# EAGLE design UV-Led (EAGLE 6.2)
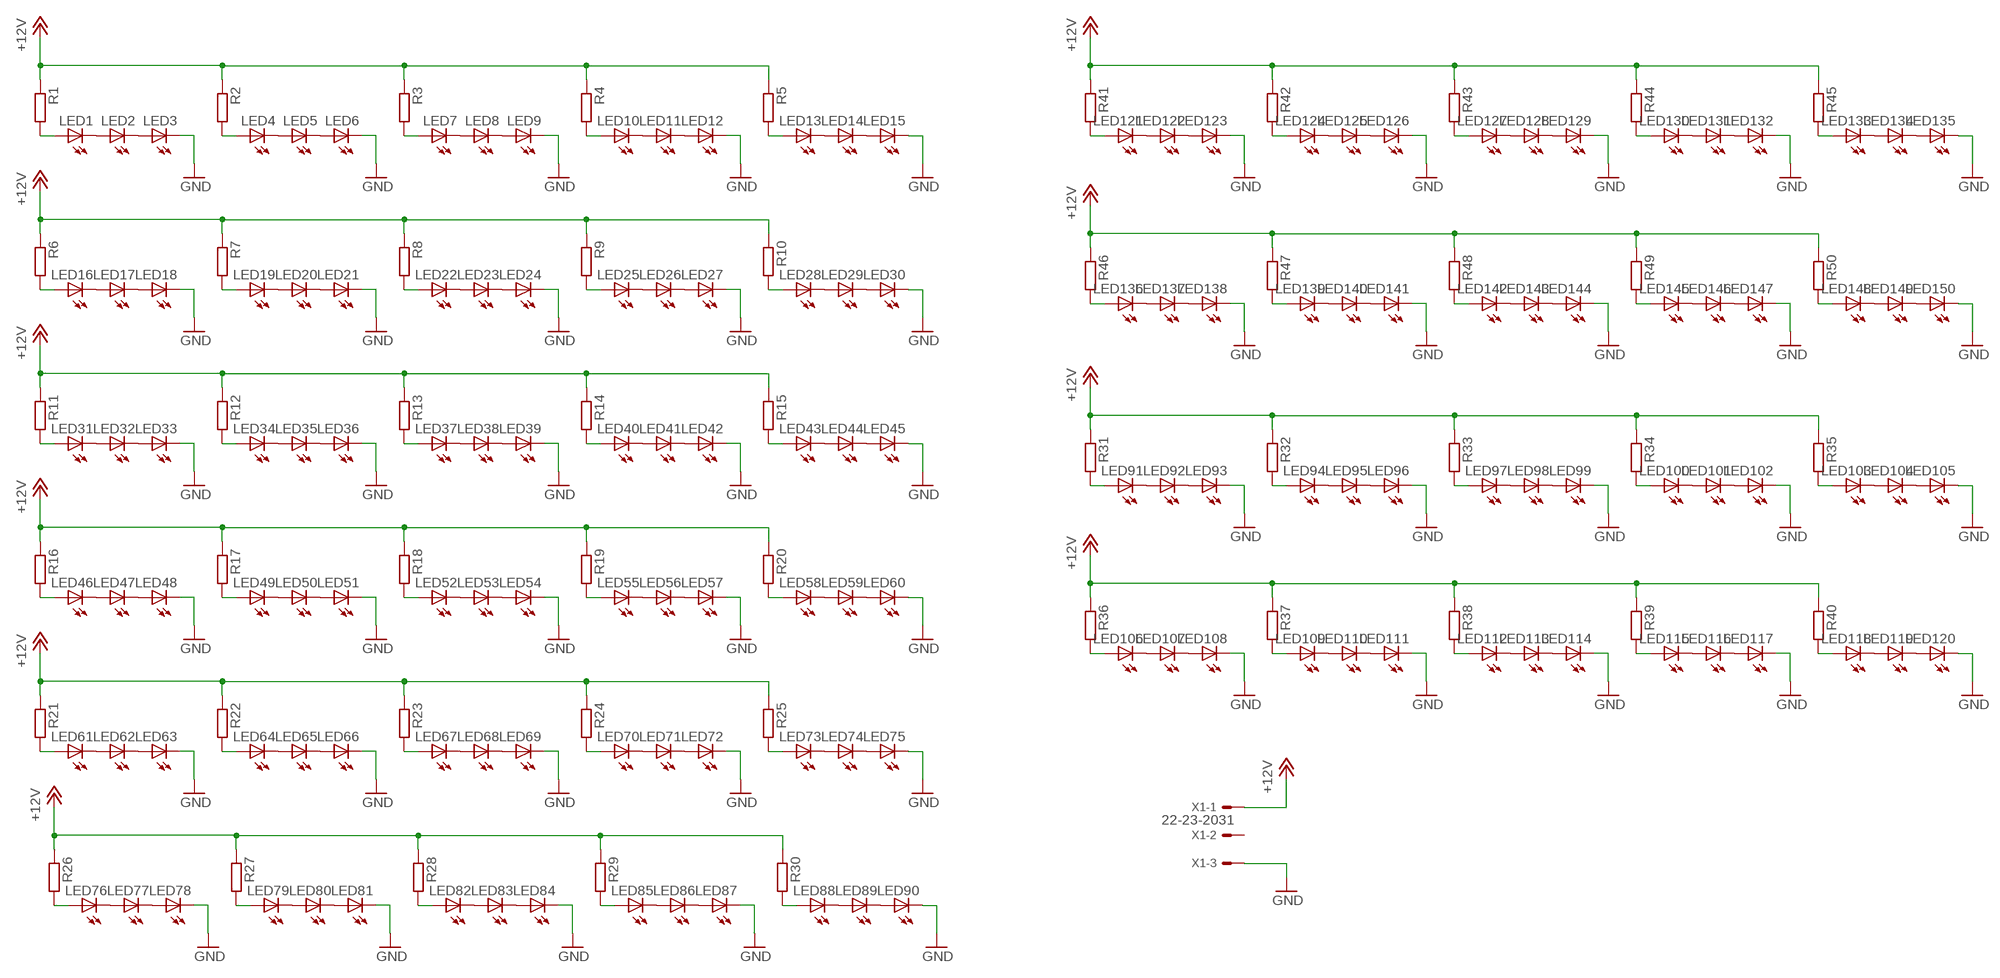
[diagram p0: schematic, sheet 1]

## Parts
LED1  LED5MM  [LED5MM]
LED2  LED5MM  [LED5MM]
LED3  LED5MM  [LED5MM]
LED4  LED5MM  [LED5MM]
LED5  LED5MM  [LED5MM]
LED6  LED5MM  [LED5MM]
LED7  LED5MM  [LED5MM]
LED8  LED5MM  [LED5MM]
LED9  LED5MM  [LED5MM]
LED10  LED5MM  [LED5MM]
LED11  LED5MM  [LED5MM]
LED12  LED5MM  [LED5MM]
LED13  LED5MM  [LED5MM]
LED14  LED5MM  [LED5MM]
LED15  LED5MM  [LED5MM]
LED16  LED5MM  [LED5MM]
LED17  LED5MM  [LED5MM]
LED18  LED5MM  [LED5MM]
LED19  LED5MM  [LED5MM]
LED20  LED5MM  [LED5MM]
LED21  LED5MM  [LED5MM]
LED22  LED5MM  [LED5MM]
LED23  LED5MM  [LED5MM]
LED24  LED5MM  [LED5MM]
LED25  LED5MM  [LED5MM]
LED26  LED5MM  [LED5MM]
LED27  LED5MM  [LED5MM]
LED28  LED5MM  [LED5MM]
LED29  LED5MM  [LED5MM]
LED30  LED5MM  [LED5MM]
LED31  LED5MM  [LED5MM]
LED32  LED5MM  [LED5MM]
LED33  LED5MM  [LED5MM]
LED34  LED5MM  [LED5MM]
LED35  LED5MM  [LED5MM]
LED36  LED5MM  [LED5MM]
LED37  LED5MM  [LED5MM]
LED38  LED5MM  [LED5MM]
LED39  LED5MM  [LED5MM]
LED40  LED5MM  [LED5MM]
LED41  LED5MM  [LED5MM]
LED42  LED5MM  [LED5MM]
LED43  LED5MM  [LED5MM]
LED44  LED5MM  [LED5MM]
LED45  LED5MM  [LED5MM]
LED46  LED5MM  [LED5MM]
LED47  LED5MM  [LED5MM]
LED48  LED5MM  [LED5MM]
LED49  LED5MM  [LED5MM]
LED50  LED5MM  [LED5MM]
LED51  LED5MM  [LED5MM]
LED52  LED5MM  [LED5MM]
LED53  LED5MM  [LED5MM]
LED54  LED5MM  [LED5MM]
LED55  LED5MM  [LED5MM]
LED56  LED5MM  [LED5MM]
LED57  LED5MM  [LED5MM]
LED58  LED5MM  [LED5MM]
LED59  LED5MM  [LED5MM]
LED60  LED5MM  [LED5MM]
LED61  LED5MM  [LED5MM]
LED62  LED5MM  [LED5MM]
LED63  LED5MM  [LED5MM]
LED64  LED5MM  [LED5MM]
LED65  LED5MM  [LED5MM]
LED66  LED5MM  [LED5MM]
LED67  LED5MM  [LED5MM]
LED68  LED5MM  [LED5MM]
LED69  LED5MM  [LED5MM]
LED70  LED5MM  [LED5MM]
LED71  LED5MM  [LED5MM]
LED72  LED5MM  [LED5MM]
LED73  LED5MM  [LED5MM]
LED74  LED5MM  [LED5MM]
LED75  LED5MM  [LED5MM]
LED76  LED5MM  [LED5MM]
LED77  LED5MM  [LED5MM]
LED78  LED5MM  [LED5MM]
LED79  LED5MM  [LED5MM]
LED80  LED5MM  [LED5MM]
LED81  LED5MM  [LED5MM]
LED82  LED5MM  [LED5MM]
LED83  LED5MM  [LED5MM]
LED84  LED5MM  [LED5MM]
LED85  LED5MM  [LED5MM]
LED86  LED5MM  [LED5MM]
LED87  LED5MM  [LED5MM]
LED88  LED5MM  [LED5MM]
LED89  LED5MM  [LED5MM]
LED90  LED5MM  [LED5MM]
LED91  LED5MM  [LED5MM]
LED92  LED5MM  [LED5MM]
LED93  LED5MM  [LED5MM]
LED94  LED5MM  [LED5MM]
LED95  LED5MM  [LED5MM]
LED96  LED5MM  [LED5MM]
LED97  LED5MM  [LED5MM]
LED98  LED5MM  [LED5MM]
LED99  LED5MM  [LED5MM]
LED100  LED5MM  [LED5MM]
LED101  LED5MM  [LED5MM]
LED102  LED5MM  [LED5MM]
LED103  LED5MM  [LED5MM]
LED104  LED5MM  [LED5MM]
LED105  LED5MM  [LED5MM]
LED106  LED5MM  [LED5MM]
LED107  LED5MM  [LED5MM]
LED108  LED5MM  [LED5MM]
LED109  LED5MM  [LED5MM]
LED110  LED5MM  [LED5MM]
LED111  LED5MM  [LED5MM]
LED112  LED5MM  [LED5MM]
LED113  LED5MM  [LED5MM]
LED114  LED5MM  [LED5MM]
LED115  LED5MM  [LED5MM]
LED116  LED5MM  [LED5MM]
LED117  LED5MM  [LED5MM]
LED118  LED5MM  [LED5MM]
LED119  LED5MM  [LED5MM]
LED120  LED5MM  [LED5MM]
LED121  LED5MM  [LED5MM]
LED122  LED5MM  [LED5MM]
LED123  LED5MM  [LED5MM]
LED124  LED5MM  [LED5MM]
LED125  LED5MM  [LED5MM]
LED126  LED5MM  [LED5MM]
LED127  LED5MM  [LED5MM]
LED128  LED5MM  [LED5MM]
LED129  LED5MM  [LED5MM]
LED130  LED5MM  [LED5MM]
LED131  LED5MM  [LED5MM]
LED132  LED5MM  [LED5MM]
LED133  LED5MM  [LED5MM]
LED134  LED5MM  [LED5MM]
LED135  LED5MM  [LED5MM]
LED136  LED5MM  [LED5MM]
LED137  LED5MM  [LED5MM]
LED138  LED5MM  [LED5MM]
LED139  LED5MM  [LED5MM]
LED140  LED5MM  [LED5MM]
LED141  LED5MM  [LED5MM]
LED142  LED5MM  [LED5MM]
LED143  LED5MM  [LED5MM]
LED144  LED5MM  [LED5MM]
LED145  LED5MM  [LED5MM]
LED146  LED5MM  [LED5MM]
LED147  LED5MM  [LED5MM]
LED148  LED5MM  [LED5MM]
LED149  LED5MM  [LED5MM]
LED150  LED5MM  [LED5MM]
R1  R-EU_0207/10  [0207/10]
R2  R-EU_0207/10  [0207/10]
R3  R-EU_0207/10  [0207/10]
R4  R-EU_0207/10  [0207/10]
R5  R-EU_0207/10  [0207/10]
R6  R-EU_0207/10  [0207/10]
R7  R-EU_0207/10  [0207/10]
R8  R-EU_0207/10  [0207/10]
R9  R-EU_0207/10  [0207/10]
R10  R-EU_0207/10  [0207/10]
R11  R-EU_0207/10  [0207/10]
R12  R-EU_0207/10  [0207/10]
R13  R-EU_0207/10  [0207/10]
R14  R-EU_0207/10  [0207/10]
R15  R-EU_0207/10  [0207/10]
R16  R-EU_0207/10  [0207/10]
R17  R-EU_0207/10  [0207/10]
R18  R-EU_0207/10  [0207/10]
R19  R-EU_0207/10  [0207/10]
R20  R-EU_0207/10  [0207/10]
R21  R-EU_0207/10  [0207/10]
R22  R-EU_0207/10  [0207/10]
R23  R-EU_0207/10  [0207/10]
R24  R-EU_0207/10  [0207/10]
R25  R-EU_0207/10  [0207/10]
R26  R-EU_0207/10  [0207/10]
R27  R-EU_0207/10  [0207/10]
R28  R-EU_0207/10  [0207/10]
R29  R-EU_0207/10  [0207/10]
R30  R-EU_0207/10  [0207/10]
R31  R-EU_0207/10  [0207/10]
R32  R-EU_0207/10  [0207/10]
R33  R-EU_0207/10  [0207/10]
R34  R-EU_0207/10  [0207/10]
R35  R-EU_0207/10  [0207/10]
R36  R-EU_0207/10  [0207/10]
R37  R-EU_0207/10  [0207/10]
R38  R-EU_0207/10  [0207/10]
R39  R-EU_0207/10  [0207/10]
R40  R-EU_0207/10  [0207/10]
R41  R-EU_0207/10  [0207/10]
R42  R-EU_0207/10  [0207/10]
R43  R-EU_0207/10  [0207/10]
R44  R-EU_0207/10  [0207/10]
R45  R-EU_0207/10  [0207/10]
R46  R-EU_0207/10  [0207/10]
R47  R-EU_0207/10  [0207/10]
R48  R-EU_0207/10  [0207/10]
R49  R-EU_0207/10  [0207/10]
R50  R-EU_0207/10  [0207/10]
X1  22-23-2031  [22-23-2031]

## Nets
+12V: R1.1 R2.1 R3.1 R4.1 R5.1 R6.1 R7.1 R8.1 R9.1 R10.1 R11.1 R12.1 R13.1 R14.1 R15.1 R16.1 R17.1 R18.1 R19.1 R20.1 R21.1 R22.1 R23.1 R24.1 R25.1 R26.1 R27.1 R28.1 R29.1 R30.1 R31.1 R32.1 R33.1 R34.1 R35.1 R36.1 R37.1 R38.1 R39.1 R40.1 R41.1 R42.1 R43.1 R44.1 R45.1 R46.1 R47.1 R48.1 R49.1 R50.1 X1.1
GND: LED3.K(C) LED6.K(C) LED9.K(C) LED12.K(C) LED15.K(C) LED18.K(C) LED21.K(C) LED24.K(C) LED27.K(C) LED30.K(C) LED33.K(C) LED36.K(C) LED39.K(C) LED42.K(C) LED45.K(C) LED48.K(C) LED51.K(C) LED54.K(C) LED57.K(C) LED60.K(C) LED63.K(C) LED66.K(C) LED69.K(C) LED72.K(C) LED75.K(C) LED78.K(C) LED81.K(C) LED84.K(C) LED87.K(C) LED90.K(C) LED93.K(C) LED96.K(C) LED99.K(C) LED102.K(C) LED105.K(C) LED108.K(C) LED111.K(C) LED114.K(C) LED117.K(C) LED120.K(C) LED123.K(C) LED126.K(C) LED129.K(C) LED132.K(C) LED135.K(C) LED138.K(C) LED141.K(C) LED144.K(C) LED147.K(C) LED150.K(C) X1.3
N$1: LED1.K(C) LED2.A
N$2: LED2.K(C) LED3.A
N$3: LED4.K(C) LED5.A
N$4: LED5.K(C) LED6.A
N$5: LED7.K(C) LED8.A
N$6: LED8.K(C) LED9.A
N$7: LED1.A R1.2
N$8: LED4.A R2.2
N$9: LED7.A R3.2
N$10: LED13.K(C) LED14.A
N$11: LED10.K(C) LED11.A
N$12: LED11.K(C) LED12.A
N$13: LED10.A R4.2
N$14: LED14.K(C) LED15.A
N$15: LED13.A R5.2
N$16: LED16.K(C) LED17.A
N$17: LED17.K(C) LED18.A
N$18: LED19.K(C) LED20.A
N$19: LED20.K(C) LED21.A
N$20: LED22.K(C) LED23.A
N$21: LED23.K(C) LED24.A
N$22: LED16.A R6.2
N$23: LED19.A R7.2
N$24: LED22.A R8.2
N$25: LED25.K(C) LED26.A
N$26: LED26.K(C) LED27.A
N$27: LED28.K(C) LED29.A
N$28: LED29.K(C) LED30.A
N$29: LED25.A R9.2
N$30: LED28.A R10.2
N$31: LED31.K(C) LED32.A
N$32: LED32.K(C) LED33.A
N$33: LED34.K(C) LED35.A
N$34: LED35.K(C) LED36.A
N$35: LED37.K(C) LED38.A
N$36: LED38.K(C) LED39.A
N$37: LED31.A R11.2
N$38: LED34.A R12.2
N$39: LED37.A R13.2
N$40: LED40.K(C) LED41.A
N$41: LED41.K(C) LED42.A
N$42: LED43.K(C) LED44.A
N$43: LED44.K(C) LED45.A
N$44: LED40.A R14.2
N$45: LED43.A R15.2
N$46: LED46.K(C) LED47.A
N$47: LED47.K(C) LED48.A
N$48: LED49.K(C) LED50.A
N$49: LED50.K(C) LED51.A
N$50: LED52.K(C) LED53.A
N$51: LED53.K(C) LED54.A
N$52: LED46.A R16.2
N$53: LED49.A R17.2
N$54: LED52.A R18.2
N$55: LED55.K(C) LED56.A
N$56: LED56.K(C) LED57.A
N$57: LED58.K(C) LED59.A
N$58: LED59.K(C) LED60.A
N$59: LED55.A R19.2
N$60: LED58.A R20.2
N$61: LED61.K(C) LED62.A
N$62: LED62.K(C) LED63.A
N$63: LED64.K(C) LED65.A
N$64: LED65.K(C) LED66.A
N$65: LED67.K(C) LED68.A
N$66: LED68.K(C) LED69.A
N$67: LED61.A R21.2
N$68: LED64.A R22.2
N$69: LED67.A R23.2
N$70: LED70.K(C) LED71.A
N$71: LED71.K(C) LED72.A
N$72: LED73.K(C) LED74.A
N$73: LED74.K(C) LED75.A
N$74: LED70.A R24.2
N$75: LED73.A R25.2
N$76: LED76.K(C) LED77.A
N$77: LED77.K(C) LED78.A
N$78: LED79.K(C) LED80.A
N$79: LED80.K(C) LED81.A
N$80: LED82.K(C) LED83.A
N$81: LED83.K(C) LED84.A
N$82: LED76.A R26.2
N$83: LED79.A R27.2
N$84: LED82.A R28.2
N$85: LED85.K(C) LED86.A
N$86: LED86.K(C) LED87.A
N$87: LED88.K(C) LED89.A
N$88: LED89.K(C) LED90.A
N$89: LED85.A R29.2
N$90: LED88.A R30.2
N$91: LED91.K(C) LED92.A
N$92: LED92.K(C) LED93.A
N$93: LED94.K(C) LED95.A
N$94: LED95.K(C) LED96.A
N$95: LED97.K(C) LED98.A
N$96: LED98.K(C) LED99.A
N$97: LED91.A R31.2
N$98: LED94.A R32.2
N$99: LED97.A R33.2
N$100: LED100.K(C) LED101.A
N$101: LED101.K(C) LED102.A
N$102: LED103.K(C) LED104.A
N$103: LED104.K(C) LED105.A
N$104: LED100.A R34.2
N$105: LED103.A R35.2
N$106: LED106.K(C) LED107.A
N$107: LED107.K(C) LED108.A
N$108: LED109.K(C) LED110.A
N$109: LED110.K(C) LED111.A
N$110: LED112.K(C) LED113.A
N$111: LED113.K(C) LED114.A
N$112: LED106.A R36.2
N$113: LED109.A R37.2
N$114: LED112.A R38.2
N$115: LED115.K(C) LED116.A
N$116: LED116.K(C) LED117.A
N$117: LED118.K(C) LED119.A
N$118: LED119.K(C) LED120.A
N$119: LED115.A R39.2
N$120: LED118.A R40.2
N$121: LED121.K(C) LED122.A
N$122: LED122.K(C) LED123.A
N$123: LED124.K(C) LED125.A
N$124: LED125.K(C) LED126.A
N$125: LED127.K(C) LED128.A
N$126: LED128.K(C) LED129.A
N$127: LED121.A R41.2
N$128: LED124.A R42.2
N$129: LED127.A R43.2
N$130: LED130.K(C) LED131.A
N$131: LED131.K(C) LED132.A
N$132: LED133.K(C) LED134.A
N$133: LED134.K(C) LED135.A
N$134: LED130.A R44.2
N$135: LED133.A R45.2
N$136: LED136.K(C) LED137.A
N$137: LED137.K(C) LED138.A
N$138: LED139.K(C) LED140.A
N$139: LED140.K(C) LED141.A
N$140: LED142.K(C) LED143.A
N$141: LED143.K(C) LED144.A
N$142: LED136.A R46.2
N$143: LED139.A R47.2
N$144: LED142.A R48.2
N$145: LED145.K(C) LED146.A
N$146: LED146.K(C) LED147.A
N$147: LED148.K(C) LED149.A
N$148: LED149.K(C) LED150.A
N$149: LED145.A R49.2
N$150: LED148.A R50.2
Unconnected: X1.2

## Library data of the parts
LED1-LED150 = led:LED: LED OSRAM: - CHIPLED LG R971, LG N971, LY N971, LG Q971, LY Q971, LO R971, LY R971 LH N974, LH R974 LS Q976, LO Q976, LY Q976 LO Q996 - Hyper CHIPLED LW Q18S LB Q993, LB Q99A, LB R99A - SideLED LS A670, LO A670, LY A670, LG A670, LP A670 LB A673, LV A673, LT A673, LW A673 LH A674 LY A675 LS A676, LA A676, LO A676, LY A676, LW A676 LS A679, LY A679, LG A679 - Hyper Micro SIDELED® LS Y876, LA Y876, LO Y876, LY Y876 LT Y87S - SmartLED LW L88C, LW L88S LB L89C, LB L89S, LG L890 LS L89K, LO L89K, LY L89K LS L896, LA L896, LO L896, LY L896 - TOPLED LS T670, LO T670, LY T670, LG T670, LP T670 LSG T670, LSP T670, LSY T670, LOP T670, LYG T670 LG T671, LOG T671, LSG T671 LB T673, LV T673, LT T673, LW T673 LH T674 LS T676, LA T676, LO T676, LY T676, LB T676, LH T676, LSB T676, LW T676 LB T67C, LV T67C, LT T67C, LS T67K, LO T67K, LY T67K, LW E67C LS E67B, LA E67B, LO E67B, LY E67B, LB E67C, LV E67C, LT E67C LW T67C LS T679, LY T679, LG T679 LS T770, LO T770, LY T770, LG T770, LP T770 LB T773, LV T773, LT T773, LW T773 LH T774 LS E675, LA E675, LY E675, LS T675 LS T776, LA T776, LO T776, LY T776, LB T776 LHGB T686 LT T68C, LB T68C - Hyper Mini TOPLED® LB M676 - Mini TOPLED Santana® LG M470 LS M47K, LO M47K, LY M47K Source: http://www.osram.convergy.de LUXEON: - LUMILED® LXK2-PW12-R00, LXK2-PW12-S00, LXK2-PW14-U00, LXK2-PW14-V00 LXK2-PM12-R00, LXK2-PM12-S00, LXK2-PM14-U00 LXK2-PE12-Q00, LXK2-PE12-R00, LXK2-PE12-S00, LXK2-PE14-T00, LXK2-PE14-U00 LXK2-PB12-K00, LXK2-PB12-L00, LXK2-PB12-M00, LXK2-PB14-N00, LXK2-PB14-P00, LXK2-PB14-Q00 LXK2-PR12-L00, LXK2-PR12-M00, LXK2-PR14-Q00, LXK2-PR14-R00 LXK2-PD12-Q00, LXK2-PD12-R00, LXK2-PD12-S00 LXK2-PH12-R00, LXK2-PH12-S00 LXK2-PL12-P00, LXK2-PL12-Q00, LXK2-PL12-R00 Source: www.luxeon.com KINGBRIGHT: KA-3528ASYC Source: www.kingbright.com
R1-R50 = resistor:R-EU_: RESISTOR, European symbol
X1 = con-molex:22-23-2031: .100" (2.54mm) Center Header - 3 Pin; MF: MOLEX; MPN: 22-23-2031; OC_FARNELL: 1462950; OC_NEWARK: 30C0862

## Board
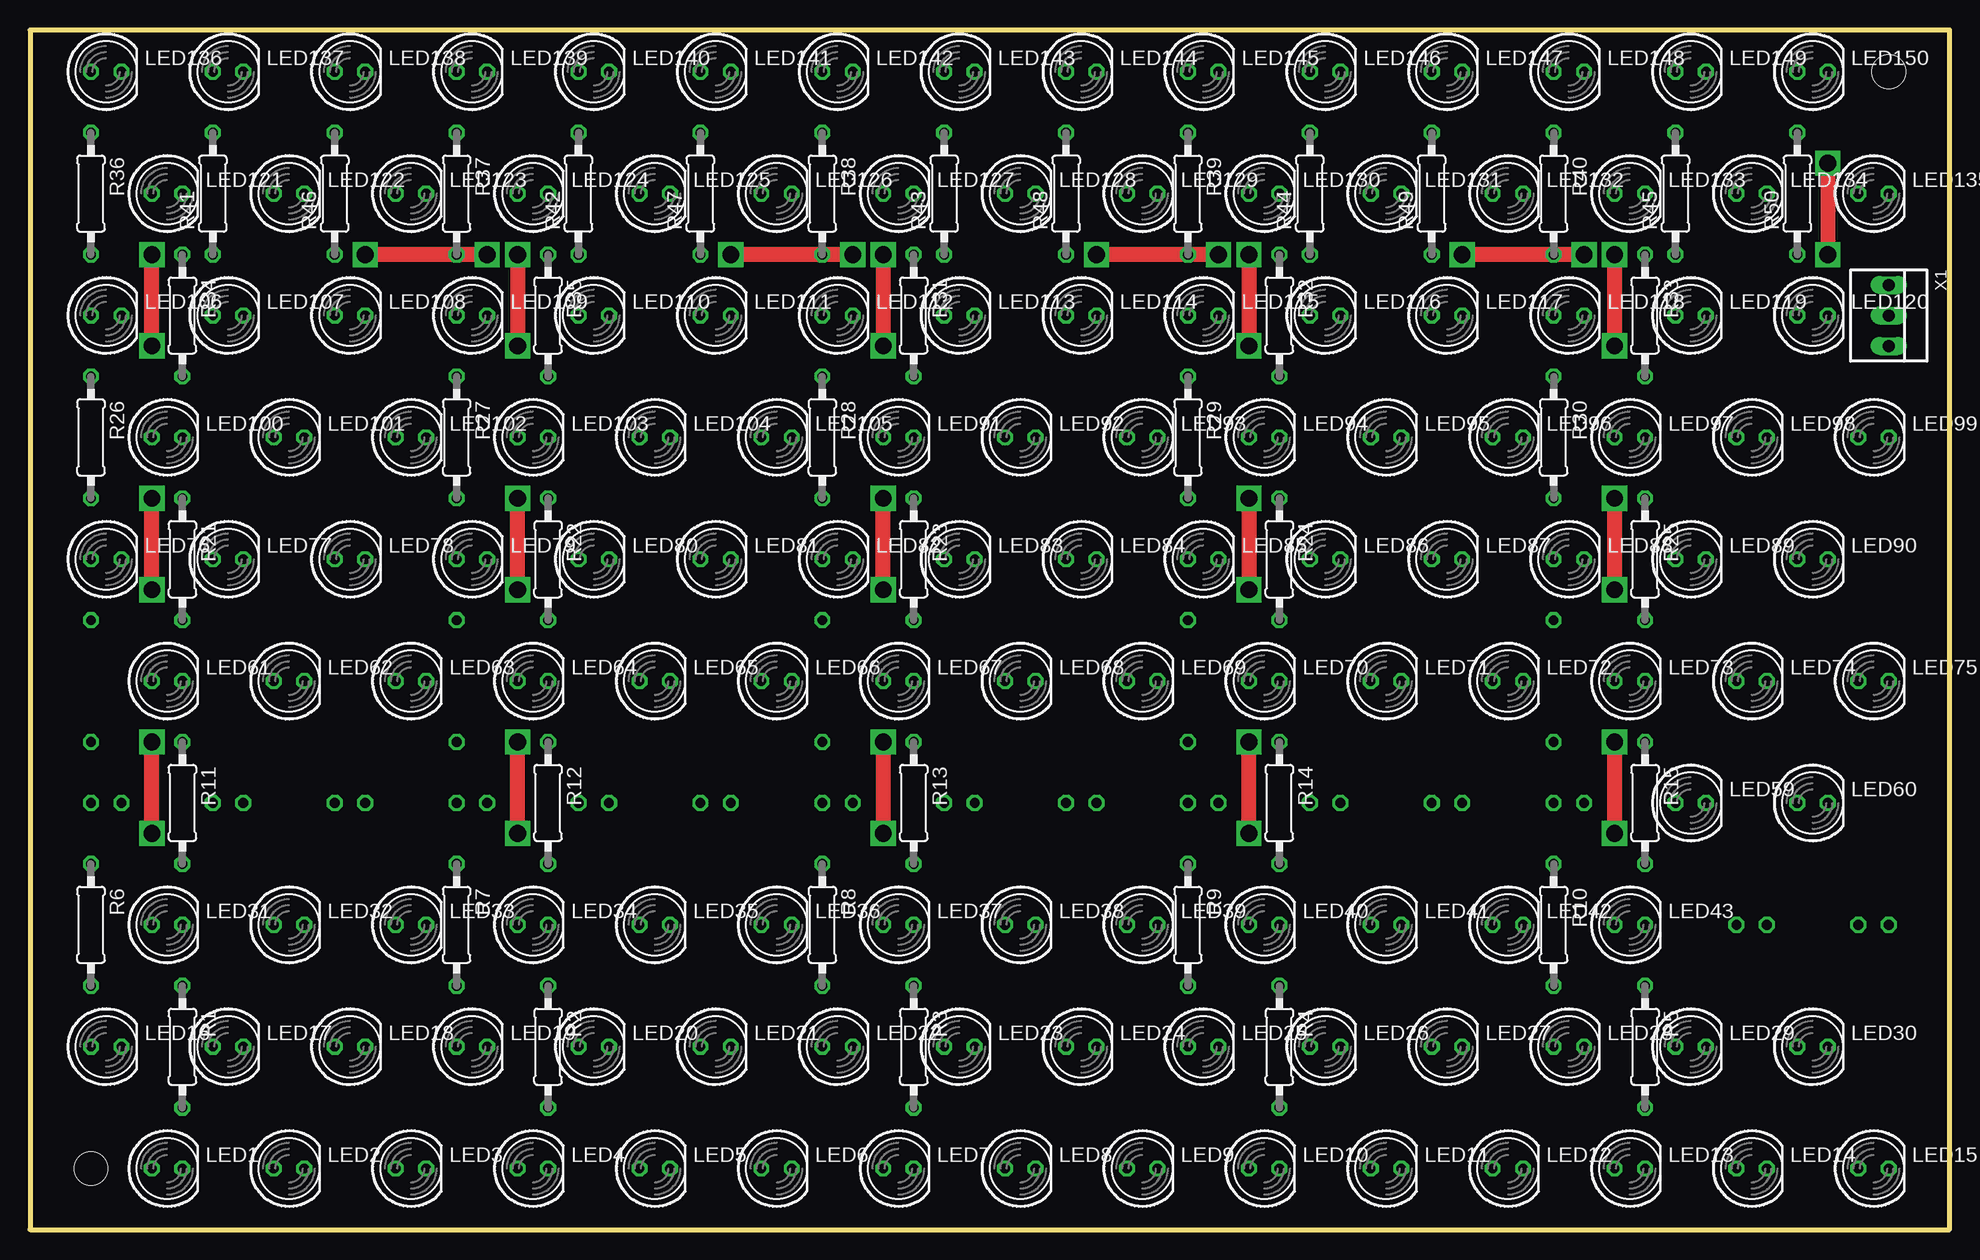
[diagram p1: board, top side]
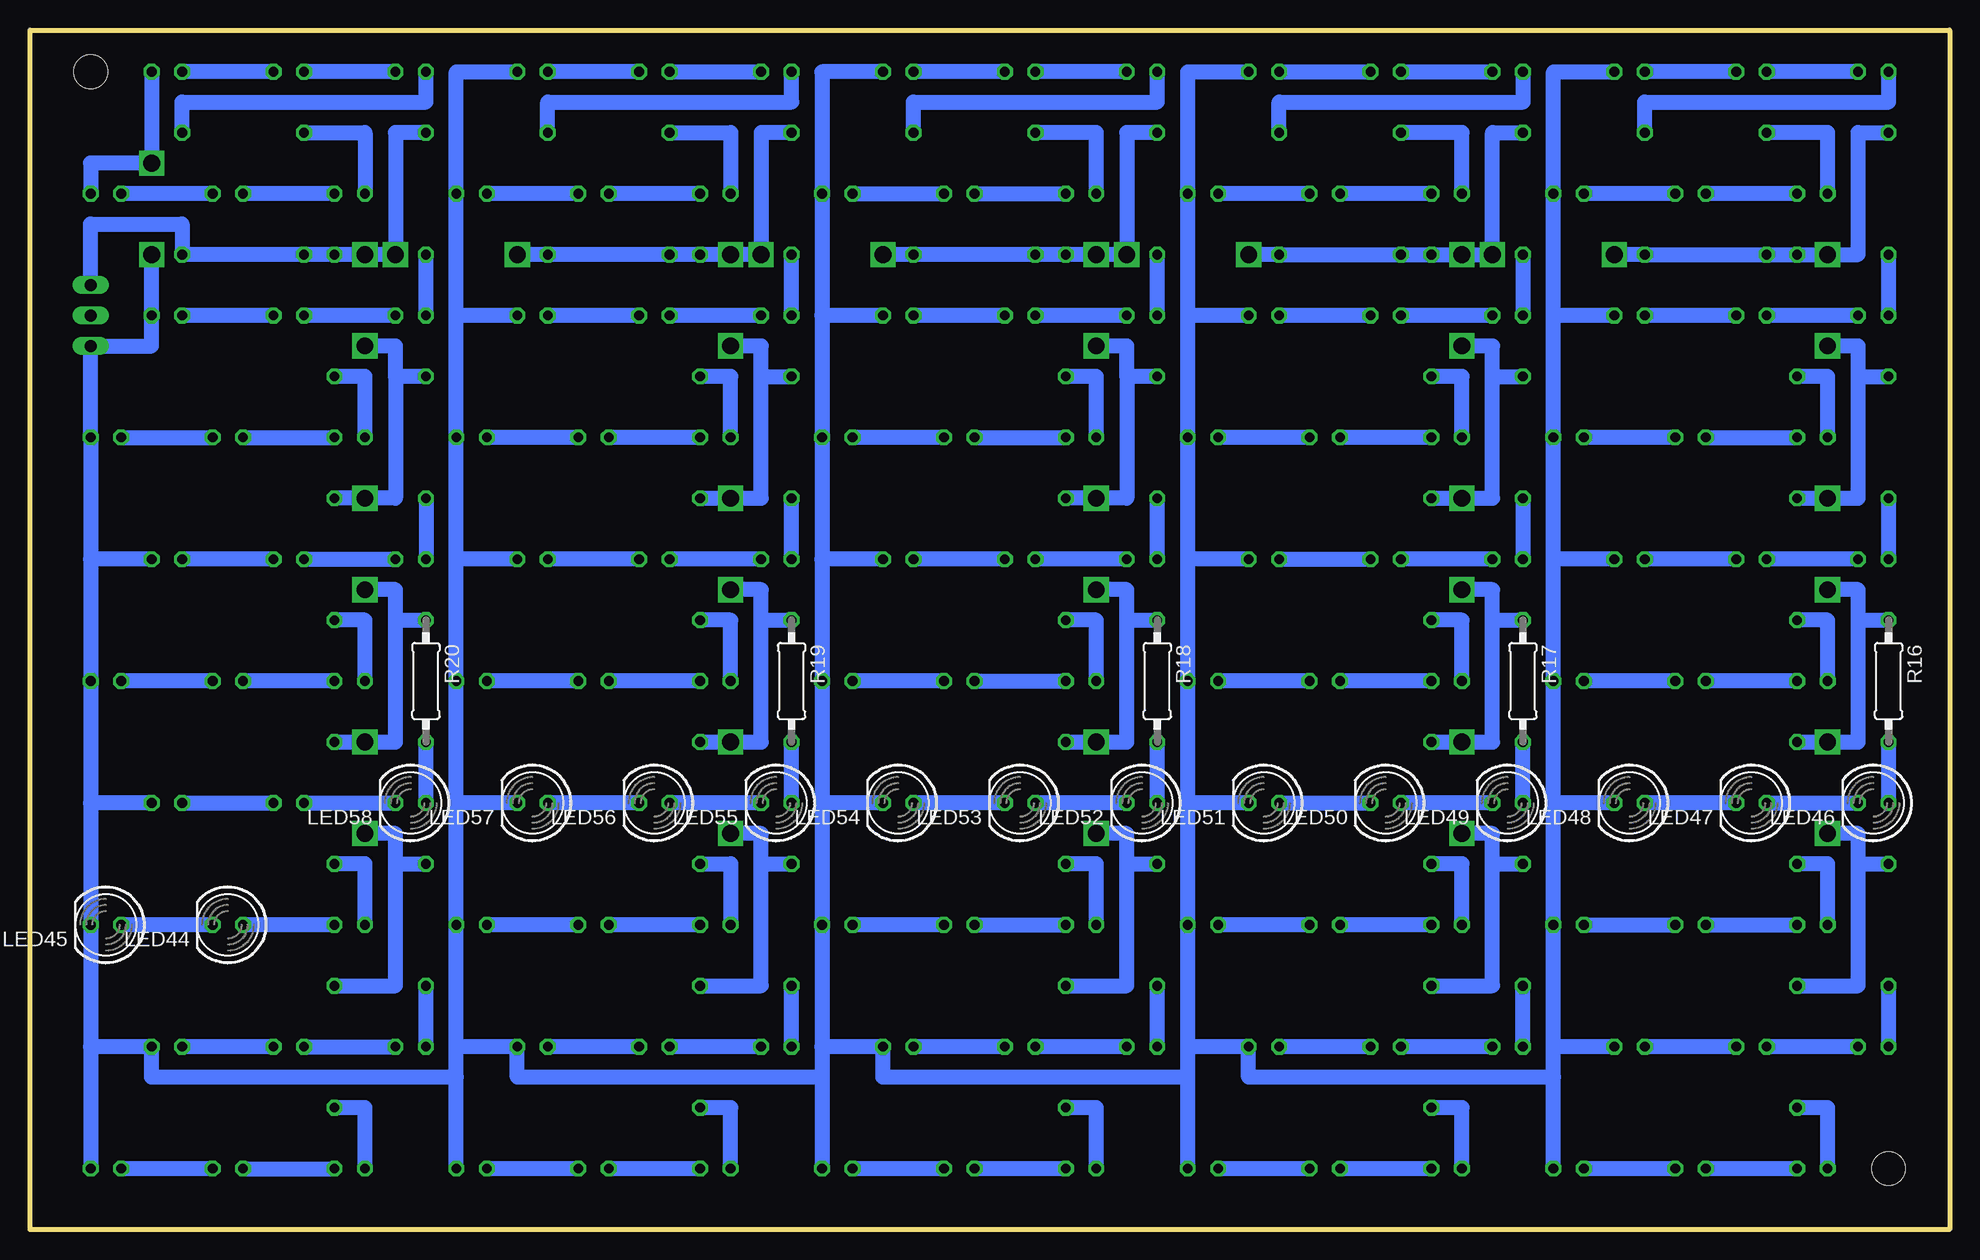
[diagram p2: board, bottom side, seen from below]

Size 160 x 100 mm. Coordinates in mm from the lower left corner, seen from the top.
Outline: 0,0 160,0 160,100 0,100 0,0
Copper layers (1*16): Top 0.035mm / dielectric 1.5mm / Bottom 0.035mm
Design rules: minimum track width 10mil, minimum drill 24mil, track to track 8mil, track to pad 8mil, pad to pad 8mil, via to via 8mil, smd to smd 8mil, copper to edge 40mil, drill to drill 8mil, minimum pad ring 10mil, minimum via ring 8mil, stop-mask expansion 4mil, vias tented up to drill 0mil, thermal gap 10mil
Holes 2.8 mm at 5.08,5.08 154.94,96.52

### Footprints (pad centres in the part's own frame; a part is rotated, then mirrored left to right if it is on the bottom)
LED5MM = drill 0.813 octagon: A -1.27,0; K 1.27,0
0207/10 = drill 0.813 octagon: 1 -5.08,0; 2 5.08,0
22-23-2031 = drill 1 long: 1 -2.54,0; 2 0,0; 3 2.54,0

### Placement (x,y rotation side)
LED1  11.43,5.08 0 top
LED2  21.59,5.08 0 top
LED3  31.75,5.08 0 top
LED4  41.91,5.08 0 top
LED5  52.07,5.08 0 top
LED6  62.23,5.08 0 top
LED7  72.39,5.08 0 top
LED8  82.55,5.08 0 top
LED9  92.71,5.08 0 top
LED10  102.87,5.08 0 top
LED11  113.03,5.08 0 top
LED12  123.19,5.08 0 top
LED13  133.35,5.08 0 top
LED14  143.51,5.08 0 top
LED15  153.67,5.08 0 top
LED16  6.35,15.24 0 top
LED17  16.51,15.24 0 top
LED18  26.67,15.24 0 top
LED19  36.83,15.24 0 top
LED20  46.99,15.24 0 top
LED21  57.15,15.24 0 top
LED22  67.31,15.24 0 top
LED23  77.47,15.24 0 top
LED24  87.63,15.24 0 top
LED25  97.79,15.24 0 top
LED26  107.95,15.24 0 top
LED27  118.11,15.24 0 top
LED28  128.27,15.24 0 top
LED29  138.43,15.24 0 top
LED30  148.59,15.24 0 top
LED31  11.43,25.4 0 top
LED32  21.59,25.4 0 top
LED33  31.75,25.4 0 top
LED34  41.91,25.4 0 top
LED35  52.07,25.4 0 top
LED36  62.23,25.4 0 top
LED37  72.39,25.4 0 top
LED38  82.55,25.4 0 top
LED39  92.71,25.4 0 top
LED40  102.87,25.4 0 top
LED41  113.03,25.4 0 top
LED42  123.19,25.4 0 top
LED43  133.35,25.4 0 top
LED44  143.51,25.4 180 bottom
LED45  153.67,25.4 180 bottom
LED46  6.35,35.56 180 bottom
LED47  16.51,35.56 180 bottom
LED48  26.67,35.56 180 bottom
LED49  36.83,35.56 180 bottom
LED50  46.99,35.56 180 bottom
LED51  57.15,35.56 180 bottom
LED52  67.31,35.56 180 bottom
LED53  77.47,35.56 180 bottom
LED54  87.63,35.56 180 bottom
LED55  97.79,35.56 180 bottom
LED56  107.95,35.56 180 bottom
LED57  118.11,35.56 180 bottom
LED58  128.27,35.56 180 bottom
LED59  138.43,35.56 0 top
LED60  148.59,35.56 0 top
LED61  11.43,45.72 0 top
LED62  21.59,45.72 0 top
LED63  31.75,45.72 0 top
LED64  41.91,45.72 0 top
LED65  52.07,45.72 0 top
LED66  62.23,45.72 0 top
LED67  72.39,45.72 0 top
LED68  82.55,45.72 0 top
LED69  92.71,45.72 0 top
LED70  102.87,45.72 0 top
LED71  113.03,45.72 0 top
LED72  123.19,45.72 0 top
LED73  133.35,45.72 0 top
LED74  143.51,45.72 0 top
LED75  153.67,45.72 0 top
LED76  6.35,55.88 0 top
LED77  16.51,55.88 0 top
LED78  26.67,55.88 0 top
LED79  36.83,55.88 0 top
LED80  46.99,55.88 0 top
LED81  57.15,55.88 0 top
LED82  67.31,55.88 0 top
LED83  77.47,55.88 0 top
LED84  87.63,55.88 0 top
LED85  97.79,55.88 0 top
LED86  107.95,55.88 0 top
LED87  118.11,55.88 0 top
LED88  128.27,55.88 0 top
LED89  138.43,55.88 0 top
LED90  148.59,55.88 0 top
LED91  72.39,66.04 0 top
LED92  82.55,66.04 0 top
LED93  92.71,66.04 0 top
LED94  102.87,66.04 0 top
LED95  113.03,66.04 0 top
LED96  123.19,66.04 0 top
LED97  133.35,66.04 0 top
LED98  143.51,66.04 0 top
LED99  153.67,66.04 0 top
LED100  11.43,66.04 0 top
LED101  21.59,66.04 0 top
LED102  31.75,66.04 0 top
LED103  41.91,66.04 0 top
LED104  52.07,66.04 0 top
LED105  62.23,66.04 0 top
LED106  6.35,76.2 0 top
LED107  16.51,76.2 0 top
LED108  26.67,76.2 0 top
LED109  36.83,76.2 0 top
LED110  46.99,76.2 0 top
LED111  57.15,76.2 0 top
LED112  67.31,76.2 0 top
LED113  77.47,76.2 0 top
LED114  87.63,76.2 0 top
LED115  97.79,76.2 0 top
LED116  107.95,76.2 0 top
LED117  118.11,76.2 0 top
LED118  128.27,76.2 0 top
LED119  138.43,76.2 0 top
LED120  148.59,76.2 0 top
LED121  11.43,86.36 0 top
LED122  21.59,86.36 0 top
LED123  31.75,86.36 0 top
LED124  41.91,86.36 0 top
LED125  52.07,86.36 0 top
LED126  62.23,86.36 0 top
LED127  72.39,86.36 0 top
LED128  82.55,86.36 0 top
LED129  92.71,86.36 0 top
LED130  102.87,86.36 0 top
LED131  113.03,86.36 0 top
LED132  123.19,86.36 0 top
LED133  133.35,86.36 0 top
LED134  143.51,86.36 0 top
LED135  153.67,86.36 0 top
LED136  6.35,96.52 0 top
LED137  16.51,96.52 0 top
LED138  26.67,96.52 0 top
LED139  36.83,96.52 0 top
LED140  46.99,96.52 0 top
LED141  57.15,96.52 0 top
LED142  67.31,96.52 0 top
LED143  77.47,96.52 0 top
LED144  87.63,96.52 0 top
LED145  97.79,96.52 0 top
LED146  107.95,96.52 0 top
LED147  118.11,96.52 0 top
LED148  128.27,96.52 0 top
LED149  138.43,96.52 0 top
LED150  148.59,96.52 0 top
R1  12.7,15.24 270 top
R2  43.18,15.24 270 top
R3  73.66,15.24 270 top
R4  104.14,15.24 270 top
R5  134.62,15.24 270 top
R6  5.08,25.4 270 top
R7  35.56,25.4 270 top
R8  66.04,25.4 270 top
R9  96.52,25.4 270 top
R10  127,25.4 270 top
R11  12.7,35.56 270 top
R12  43.18,35.56 270 top
R13  73.66,35.56 270 top
R14  104.14,35.56 270 top
R15  134.62,35.56 270 top
R16  5.08,45.72 270 bottom
R17  35.56,45.72 270 bottom
R18  66.04,45.72 270 bottom
R19  96.52,45.72 270 bottom
R20  127,45.72 270 bottom
R21  12.7,55.88 270 top
R22  43.18,55.88 270 top
R23  73.66,55.88 270 top
R24  104.14,55.88 270 top
R25  134.62,55.88 270 top
R26  5.08,66.04 270 top
R27  35.56,66.04 270 top
R28  66.04,66.04 270 top
R29  96.52,66.04 270 top
R30  127,66.04 270 top
R31  73.66,76.2 270 top
R32  104.14,76.2 270 top
R33  134.62,76.2 270 top
R34  12.7,76.2 270 top
R35  43.18,76.2 270 top
R36  5.08,86.36 270 top
R37  35.56,86.36 270 top
R38  66.04,86.36 270 top
R39  96.52,86.36 270 top
R40  127,86.36 270 top
R41  15.24,86.36 90 top
R42  45.72,86.36 90 top
R43  76.2,86.36 90 top
R44  106.68,86.36 90 top
R45  137.16,86.36 90 top
R46  25.4,86.36 90 top
R47  55.88,86.36 90 top
R48  86.36,86.36 90 top
R49  116.84,86.36 90 top
R50  147.32,86.36 90 top
X1  154.94,76.2 270 top

### Tracks (layer width: path | path; a pad name or v marks a point on that pad's centre or on a via)
+12V  (via drill 1.4)
  Top 1.27: v40.64,33.02 v40.64,40.64 | v40.64,53.34 v40.64,60.96 | v40.64,81.28 v40.64,73.66 | v10.16,33.02 v10.16,40.64 | v10.16,53.34 v10.16,60.96 | v10.16,73.66 v10.16,81.28 | v71.12,81.28 v71.12,73.66 | v101.6,81.28 v101.6,73.66 | v101.6,60.96 v101.6,53.34 | v71.12,53.34 v71.12,60.96 | v71.12,40.64 v71.12,33.02 | v101.6,33.02 v101.6,40.64 | v132.08,81.28 v132.08,73.66 | v132.08,60.96 v132.08,53.34 | v132.08,40.64 v132.08,33.02 | v38.1,81.28 v27.94,81.28 | v68.58,81.28 v58.42,81.28 | v99.06,81.28 v88.9,81.28 | v129.54,81.28 v119.38,81.28
  Bottom 1.27: R2.1 38.1,20.32 38.1,30.48 | 38.1,30.48 R7.1 | R12.1 v40.64,40.64 38.1,40.64 38.1,50.8 | 38.1,50.8 R17.1 | R22.1 v40.64,60.96 38.1,60.96 38.1,71.12 | 38.1,71.12 R27.1 | R37.1 38.1,91.44 v38.1,81.28 v40.64,81.28 R35.1 R42.1 R47.1 v58.42,81.28 | R1.1 7.62,20.32 7.62,30.48 | 7.62,30.48 R6.1 | R11.1 v10.16,40.64 7.62,40.64 7.62,50.8 | 7.62,50.8 R16.1 | R36.1 7.62,91.44 7.62,81.28 v10.16,81.28 R34.1 R41.1 R46.1 v27.94,81.28 | R21.1 v10.16,60.96 7.62,60.96 7.62,71.12 | 7.62,71.12 R26.1 | 38.1,30.48 38.1,33.02 v40.64,33.02 | 38.1,71.12 38.1,73.66 v40.64,73.66 | 38.1,50.8 38.1,53.34 v40.64,53.34 | 7.62,30.48 7.62,33.02 v10.16,33.02 | 7.62,50.8 7.62,53.34 v10.16,53.34 | 7.62,71.12 7.62,73.66 v10.16,73.66 | R38.1 68.58,91.44 v68.58,81.28 v71.12,81.28 R31.1 R43.1 R48.1 v88.9,81.28 | R28.1 68.58,71.12 | 68.58,71.12 68.58,60.96 v71.12,60.96 R23.1 | R3.1 68.58,20.32 68.58,30.48 | 68.58,30.48 R8.1 | R13.1 v71.12,40.64 68.58,40.64 68.58,50.8 | 68.58,50.8 R18.1 | 68.58,30.48 68.58,33.02 v71.12,33.02 | 68.58,50.8 68.58,53.34 v71.12,53.34 | 68.58,71.12 68.58,73.66 v71.12,73.66 | R39.1 99.06,91.44 v99.06,81.28 v101.6,81.28 R32.1 R44.1 R49.1 v119.38,81.28 | R24.1 v101.6,60.96 99.06,60.96 99.06,71.12 | 99.06,71.12 R29.1 | R14.1 v101.6,40.64 99.06,40.64 99.06,50.8 | 99.06,50.8 R19.1 | R4.1 99.06,20.32 99.06,30.48 | 99.06,30.48 R9.1 | 99.06,30.48 99.06,33.02 v101.6,33.02 | 99.06,50.8 99.06,53.34 v101.6,53.34 | 99.06,71.12 99.06,73.66 v101.6,73.66 | R40.1 129.54,91.44 v129.54,81.28 v132.08,81.28 R33.1 R45.1 R50.1 147.32,83.82 154.94,83.82 X1.1 | R5.1 129.54,20.32 129.54,30.48 | 129.54,30.48 R10.1 | R15.1 v132.08,40.64 129.54,40.64 129.54,50.8
  Bottom 1.27: 129.54,50.8 R20.1 | R30.1 129.54,71.12 | 129.54,71.12 129.54,60.96 v132.08,60.96 R25.1 | 129.54,71.12 129.54,73.66 v132.08,73.66 | 129.54,50.8 129.54,53.34 v132.08,53.34 | 129.54,30.48 129.54,33.02 v132.08,33.02
GND  (via drill 1.4)
  Top 1.27: v149.86,88.9 v149.86,81.28
  Bottom 1.27: LED3.K 33.02,12.7 | 33.02,12.7 33.02,15.24 | 33.02,15.24 LED33.K 33.02,35.56 | 33.02,35.56 LED63.K 33.02,55.88 | 33.02,55.88 LED102.K 33.02,76.2 | 33.02,76.2 LED123.K 33.02,96.52 LED138.K | LED18.K 33.02,15.24 | LED48.K 33.02,35.56 | LED78.K 33.02,55.88 | LED108.K 33.02,76.2 | LED6.K 63.5,12.7 | 63.5,12.7 63.5,15.24 | 63.5,15.24 LED36.K 63.5,35.56 | 63.5,35.56 LED66.K 63.5,55.88 | 63.5,55.88 LED105.K 63.5,76.2 | 63.5,76.2 LED126.K 63.5,96.52 LED141.K | LED81.K 63.5,55.88 | 63.5,15.24 LED21.K 58.42,12.7 33.02,12.7 | LED111.K 63.5,76.2 | LED51.K 63.5,35.56 | LED144.K 93.98,96.52 LED129.K 93.98,76.2 | 93.98,76.2 LED93.K 93.98,55.88 | 93.98,35.56 LED69.K 93.98,55.88 | 93.98,35.56 LED39.K 93.98,15.24 | 93.98,15.24 93.98,12.7 | 93.98,12.7 LED9.K | LED114.K 93.98,76.2 | LED84.K 93.98,55.88 | LED54.K 93.98,35.56 | 93.98,15.24 LED24.K 88.9,12.7 63.5,12.7 | LED12.K 124.46,12.7 | 124.46,12.7 124.46,15.24 | 124.46,15.24 LED42.K 124.46,35.56 | 124.46,35.56 LED72.K 124.46,55.88 | 124.46,55.88 LED96.K 124.46,76.2 | 124.46,76.2 LED132.K 124.46,96.52 LED147.K | 124.46,15.24 LED27.K 119.38,12.7 93.98,12.7 | LED57.K 124.46,35.56 | LED87.K 124.46,55.88 | LED117.K 124.46,76.2 | 154.94,55.88 LED99.K X1.3 149.86,73.66 LED120.K v149.86,81.28 | 154.94,55.88 LED75.K 154.94,35.56 | 154.94,35.56 LED45.K 154.94,15.24 | 154.94,15.24 LED15.K | LED60.K 154.94,35.56 | 154.94,15.24 LED30.K 149.86,12.7 124.46,12.7 | LED90.K 154.94,55.88 | LED150.K v149.86,88.9 154.94,88.9 LED135.K
N$1
  Bottom 1.27: LED1.K LED2.A
N$2
  Bottom 1.27: LED2.K LED3.A
N$3
  Bottom 1.27: LED4.K LED5.A
N$4
  Bottom 1.27: LED5.K LED6.A
N$5
  Bottom 1.27: LED7.K LED8.A
N$6
  Bottom 1.27: LED8.K LED9.A
N$7
  Bottom 1.27: LED1.A 10.16,10.16 R1.2
N$8
  Bottom 1.27: LED4.A 40.64,10.16 R2.2
N$9
  Bottom 1.27: LED7.A 71.12,10.16 R3.2
N$10
  Bottom 1.27: LED14.A LED13.K
N$11
  Bottom 1.27: LED10.K LED11.A
N$12
  Bottom 1.27: LED11.K LED12.A
N$13
  Bottom 1.27: LED10.A 101.6,10.16 R4.2
N$14
  Bottom 1.27: LED14.K LED15.A
N$15
  Bottom 1.27: LED13.A 132.08,10.16 R5.2
N$16
  Bottom 1.27: LED16.K LED17.A
N$17
  Bottom 1.27: LED17.K LED18.A
N$18
  Bottom 1.27: LED19.K LED20.A
N$19
  Bottom 1.27: LED20.K LED21.A
N$20
  Bottom 1.27: LED22.K LED23.A
N$21
  Bottom 1.27: LED23.K LED24.A
N$22
  Bottom 1.27: LED16.A R6.2
N$23
  Bottom 1.27: LED19.A R7.2
N$24
  Bottom 1.27: LED22.A R8.2
N$25
  Bottom 1.27: LED25.K LED26.A
N$26
  Bottom 1.27: LED26.K LED27.A
N$27
  Bottom 1.27: LED29.A LED28.K
N$28
  Bottom 1.27: LED29.K LED30.A
N$29
  Bottom 1.27: LED25.A R9.2
N$30
  Bottom 1.27: LED28.A R10.2
N$31
  Bottom 1.27: LED32.A LED31.K
N$32
  Bottom 1.27: LED33.A LED32.K
N$33
  Bottom 1.27: LED34.K LED35.A
N$34
  Bottom 1.27: LED35.K LED36.A
N$35
  Bottom 1.27: LED38.A LED37.K
N$36
  Bottom 1.27: LED38.K LED39.A
N$37
  Bottom 1.27: LED31.A 10.16,30.48 R11.2
N$38
  Bottom 1.27: LED34.A 40.64,30.48 R12.2
N$39
  Bottom 1.27: LED37.A 71.12,30.48 R13.2
N$40
  Bottom 1.27: LED40.K LED41.A
N$41
  Bottom 1.27: LED41.K LED42.A
N$42
  Bottom 1.27: LED43.K LED44.A
N$43
  Bottom 1.27: LED44.K LED45.A
N$44
  Bottom 1.27: R14.2 101.6,30.48 LED40.A
N$45
  Bottom 1.27: LED43.A 132.08,30.48 R15.2
N$46
  Bottom 1.27: LED47.A LED46.K
N$47
  Bottom 1.27: LED47.K LED48.A
N$48
  Bottom 1.27: LED49.K LED50.A
N$49
  Bottom 1.27: LED51.A LED50.K
N$50
  Bottom 1.27: LED52.K LED53.A
N$51
  Bottom 1.27: LED53.K LED54.A
N$52
  Bottom 1.27: LED46.A R16.2
N$53
  Bottom 1.27: LED49.A R17.2
N$54
  Bottom 1.27: LED52.A R18.2
N$55
  Bottom 1.27: LED55.K LED56.A
N$56
  Bottom 1.27: LED56.K LED57.A
N$57
  Bottom 1.27: LED59.A LED58.K
N$58
  Bottom 1.27: LED60.A LED59.K
N$59
  Bottom 1.27: LED55.A R19.2
N$60
  Bottom 1.27: LED58.A R20.2
N$61
  Bottom 1.27: LED61.K LED62.A
N$62
  Bottom 1.27: LED62.K LED63.A
N$63
  Bottom 1.27: LED64.K LED65.A
N$64
  Bottom 1.27: LED65.K LED66.A
N$65
  Bottom 1.27: LED68.A LED67.K
N$66
  Bottom 1.27: LED68.K LED69.A
N$67
  Bottom 1.27: LED61.A 10.16,50.8 R21.2
N$68
  Bottom 1.27: LED64.A 40.64,50.8 R22.2
N$69
  Bottom 1.27: LED67.A 71.12,50.8 R23.2
N$70
  Bottom 1.27: LED70.K LED71.A
N$71
  Bottom 1.27: LED71.K LED72.A
N$72
  Bottom 1.27: LED73.K LED74.A
N$73
  Bottom 1.27: LED74.K LED75.A
N$74
  Bottom 1.27: LED70.A 101.6,50.8 R24.2
N$75
  Bottom 1.27: LED73.A 132.08,50.8 R25.2
N$76
  Bottom 1.27: LED76.K LED77.A
N$77
  Bottom 1.27: LED77.K LED78.A
N$78
  Bottom 1.27: LED79.K LED80.A
N$79
  Bottom 1.27: LED81.A LED80.K
N$80
  Bottom 1.27: LED82.K LED83.A
N$81
  Bottom 1.27: LED83.K LED84.A
N$82
  Bottom 1.27: LED76.A R26.2
N$83
  Bottom 1.27: R27.2 LED79.A
N$84
  Bottom 1.27: LED82.A R28.2
N$85
  Bottom 1.27: LED85.K LED86.A
N$86
  Bottom 1.27: LED86.K LED87.A
N$87
  Bottom 1.27: LED89.A LED88.K
N$88
  Bottom 1.27: LED89.K LED90.A
N$89
  Bottom 1.27: LED85.A R29.2
N$90
  Bottom 1.27: R30.2 LED88.A
N$91
  Bottom 1.27: LED92.A LED91.K
N$92
  Bottom 1.27: LED92.K LED93.A
N$93
  Bottom 1.27: LED94.K LED95.A
N$94
  Bottom 1.27: LED95.K LED96.A
N$95
  Bottom 1.27: LED98.A LED97.K
N$96
  Bottom 1.27: LED99.A LED98.K
N$97
  Bottom 1.27: LED91.A 71.12,71.12 R31.2
N$98
  Bottom 1.27: LED94.A 101.6,71.12 R32.2
N$99
  Bottom 1.27: LED97.A 132.08,71.12 R33.2
N$100
  Bottom 1.27: LED101.A LED100.K
N$101
  Bottom 1.27: LED101.K LED102.A
N$102
  Bottom 1.27: LED103.K LED104.A
N$103
  Bottom 1.27: LED104.K LED105.A
N$104
  Bottom 1.27: LED100.A 10.16,71.12 R34.2
N$105
  Bottom 1.27: LED103.A 40.64,71.12 R35.2
N$106
  Bottom 1.27: LED106.K LED107.A
N$107
  Bottom 1.27: LED107.K LED108.A
N$108
  Bottom 1.27: LED109.K LED110.A
N$109
  Bottom 1.27: LED110.K LED111.A
N$110
  Bottom 1.27: LED112.K LED113.A
N$111
  Bottom 1.27: LED113.K LED114.A
N$112
  Bottom 1.27: LED106.A R36.2
N$113
  Bottom 1.27: R37.2 LED109.A
N$114
  Bottom 1.27: LED112.A R38.2
N$115
  Bottom 1.27: LED115.K LED116.A
N$116
  Bottom 1.27: LED116.K LED117.A
N$117
  Bottom 1.27: LED118.K LED119.A
N$118
  Bottom 1.27: LED119.K LED120.A
N$119
  Bottom 1.27: LED115.A R39.2
N$120
  Bottom 1.27: LED118.A R40.2
N$121
  Bottom 1.27: LED121.K LED122.A
N$122
  Bottom 1.27: LED122.K LED123.A
N$123
  Bottom 1.27: LED124.K LED125.A
N$124
  Bottom 1.27: LED125.K LED126.A
N$125
  Bottom 1.27: LED128.A LED127.K
N$126
  Bottom 1.27: LED129.A LED128.K
N$127
  Bottom 1.27: LED121.A 10.16,91.44 R41.2
N$128
  Bottom 1.27: LED124.A 40.64,91.44 R42.2
N$129
  Bottom 1.27: LED127.A 71.12,91.44 R43.2
N$130
  Bottom 1.27: LED130.K LED131.A
N$131
  Bottom 1.27: LED131.K LED132.A
N$132
  Bottom 1.27: LED133.K LED134.A
N$133
  Bottom 1.27: LED134.K LED135.A
N$134
  Bottom 1.27: R44.2 101.6,91.44 LED130.A
N$135
  Bottom 1.27: R45.2 132.08,91.44 LED133.A
N$136
  Bottom 1.27: LED136.K LED137.A
N$137
  Bottom 1.27: LED137.K LED138.A
N$138
  Bottom 1.27: LED140.A LED139.K
N$139
  Bottom 1.27: LED141.A LED140.K
N$140
  Bottom 1.27: LED142.K LED143.A
N$141
  Bottom 1.27: LED143.K LED144.A
N$142
  Bottom 1.27: R46.2 25.4,93.98 5.08,93.98 LED136.A
N$143
  Bottom 1.27: LED139.A 35.56,93.98 55.88,93.98 R47.2
N$144
  Bottom 1.27: R48.2 86.36,93.98 66.04,93.98 LED142.A
N$145
  Bottom 1.27: LED146.A LED145.K
N$146
  Bottom 1.27: LED146.K LED147.A
N$147
  Bottom 1.27: LED148.K LED149.A
N$148
  Bottom 1.27: LED149.K LED150.A
N$149
  Bottom 1.27: R49.2 116.84,93.98 96.52,93.98 LED145.A
N$150
  Bottom 1.27: R50.2 147.32,93.98 127,93.98 LED148.A